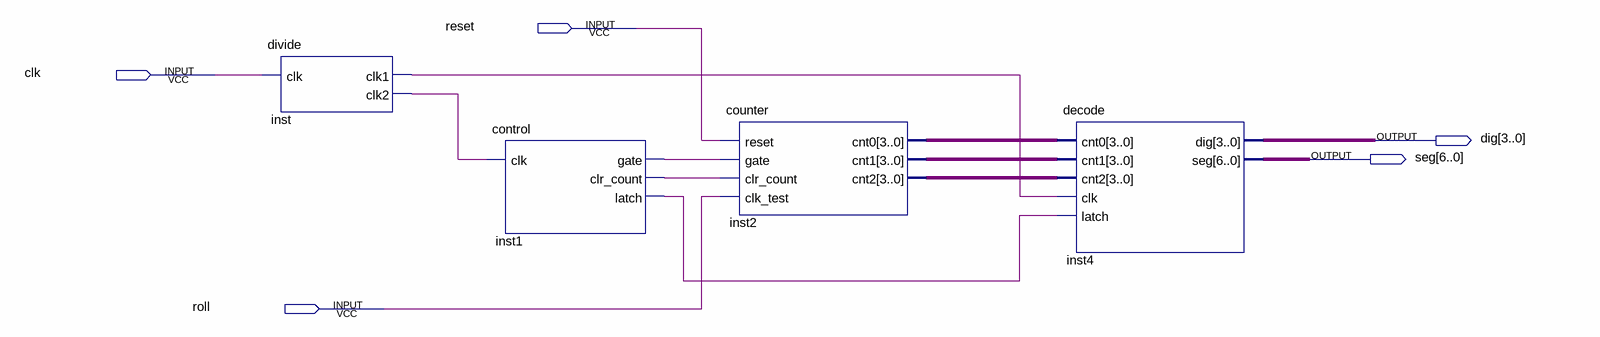
[diagram p0: schematic sheet]
// Quartus schematic f_count.bdf as structural Verilog: 4 symbols, 5 pins
module f_count (
  input  reset,
  input  clk,
  input  roll,
  output [3:0] dig,
  output [6:0] seg
);

  wire inst1_clr_count, inst1_gate, inst1_latch, inst_clk1, inst_clk2;
  wire [3:0] inst2_cnt0, inst2_cnt1, inst2_cnt2;

  divide inst (.clk(clk), .clk1(inst_clk1), .clk2(inst_clk2));
  control inst1 (.clk(inst_clk2), .gate(inst1_gate), .clr_count(inst1_clr_count), .latch(inst1_latch));
  counter inst2 (
    .reset(reset), .gate(inst1_gate), .clr_count(inst1_clr_count), .clk_test(roll), .cnt0(inst2_cnt0),
    .cnt1(inst2_cnt1), .cnt2(inst2_cnt2));
  decode inst4 (
    .cnt0(inst2_cnt0), .cnt1(inst2_cnt1), .cnt2(inst2_cnt2), .clk(inst_clk1), .latch(inst1_latch), .dig(dig),
    .seg(seg));
endmodule
